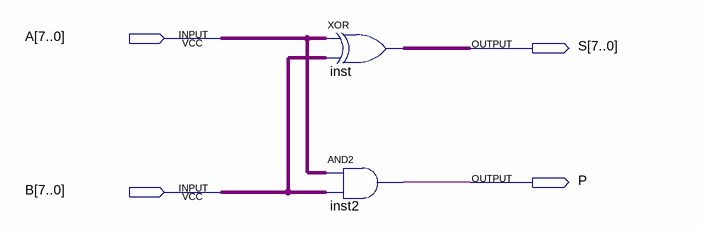
[diagram p0: schematic sheet]
// Quartus schematic ADD.bdf as structural Verilog: 2 symbols, 4 pins
module ADD (
  input  [7:0] A,
  input  [7:0] B,
  output [7:0] S,
  output P
);

  assign S = A ^ B;  // XOR inst, 8 bits wide
  assign P = A & B;  // AND2 inst2, 8 bits wide
endmodule
